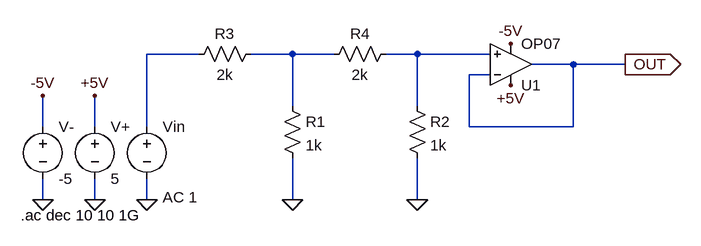
[diagram p0: schematic attenuator.asc]
attenuator.asc, the LTspice schematic file:
Version 4
SHEET 1 880 680
WIRE -48 48 -128 48
WIRE 96 48 32 48
WIRE 160 48 96 48
WIRE 288 48 240 48
WIRE 400 48 288 48
WIRE 528 64 464 64
WIRE 608 64 528 64
WIRE 400 80 368 80
WIRE 96 128 96 48
WIRE 288 128 288 48
WIRE -288 160 -288 112
WIRE -208 160 -208 112
WIRE -128 160 -128 48
WIRE 368 160 368 80
WIRE 528 160 528 64
WIRE 528 160 368 160
WIRE -288 272 -288 240
WIRE -208 272 -208 240
WIRE -128 272 -128 240
WIRE 96 272 96 208
WIRE 288 272 288 208
FLAG -288 272 0
FLAG -208 272 0
FLAG -128 272 0
FLAG -288 112 -5V
FLAG -208 112 +5V
FLAG 432 32 -5V
FLAG 432 96 +5V
FLAG 608 64 OUT
IOPIN 608 64 Out
FLAG 96 272 0
FLAG 288 272 0
SYMBOL res 80 112 R0
SYMATTR InstName R1
SYMATTR Value 1k
SYMBOL res 272 112 R0
SYMATTR InstName R2
SYMATTR Value 1k
SYMBOL res 48 32 R90
WINDOW 0 0 56 VBottom 2
WINDOW 3 32 56 VTop 2
SYMATTR InstName R3
SYMATTR Value 2k
SYMBOL res 256 32 R90
WINDOW 0 0 56 VBottom 2
WINDOW 3 32 56 VTop 2
SYMATTR InstName R4
SYMATTR Value 2k
SYMBOL OpAmps\\OP07 432 128 M180
SYMATTR InstName U1
SYMBOL voltage -288 144 R0
WINDOW 123 0 0 Left 0
WINDOW 39 0 0 Left 0
SYMATTR InstName V-
SYMATTR Value -5
SYMBOL voltage -208 144 R0
WINDOW 123 0 0 Left 0
WINDOW 39 0 0 Left 0
SYMATTR InstName V+
SYMATTR Value 5
SYMBOL voltage -128 144 R0
WINDOW 123 24 124 Left 2
WINDOW 39 0 0 Left 0
SYMATTR InstName Vin
SYMATTR Value ""
SYMATTR Value2 AC 1
TEXT -322 296 Left 2 !.ac dec 10 10 1G

The netlist it stands for:
* attenuator.asc
R1 N002 0 1k
R2 N003 0 1k
R3 N002 N001 2k
R4 N003 N002 2k
XU1 N003 OUT +5V -5V OUT LT1001  ; OP07, pins In+ In- V+ V- OUT
V- -5V 0 -5
V+ +5V 0 5
Vin N001 0 AC 1
.ac dec 10 10 1G
.lib LTC.lib
.backanno
.end